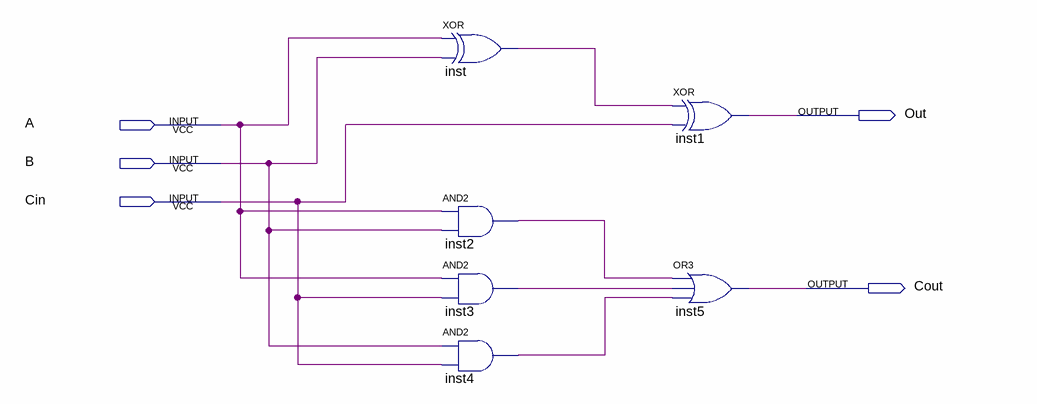
[diagram p0: schematic sheet]
// Quartus schematic SomadorCompletoBit.bdf as structural Verilog: 6 symbols, 5 pins
module SomadorCompletoBit (
  input  A,
  input  B,
  input  Cin,
  output Out,
  output Cout
);

  wire inst2_out, inst3_out, inst4_out, inst_out;

  xor inst (inst_out, A, B);
  and inst2 (inst2_out, A, B);
  and inst3 (inst3_out, A, Cin);
  and inst4 (inst4_out, B, Cin);
  xor inst1 (Out, inst_out, Cin);
  or inst5 (Cout, inst2_out, inst3_out, inst4_out);
endmodule
